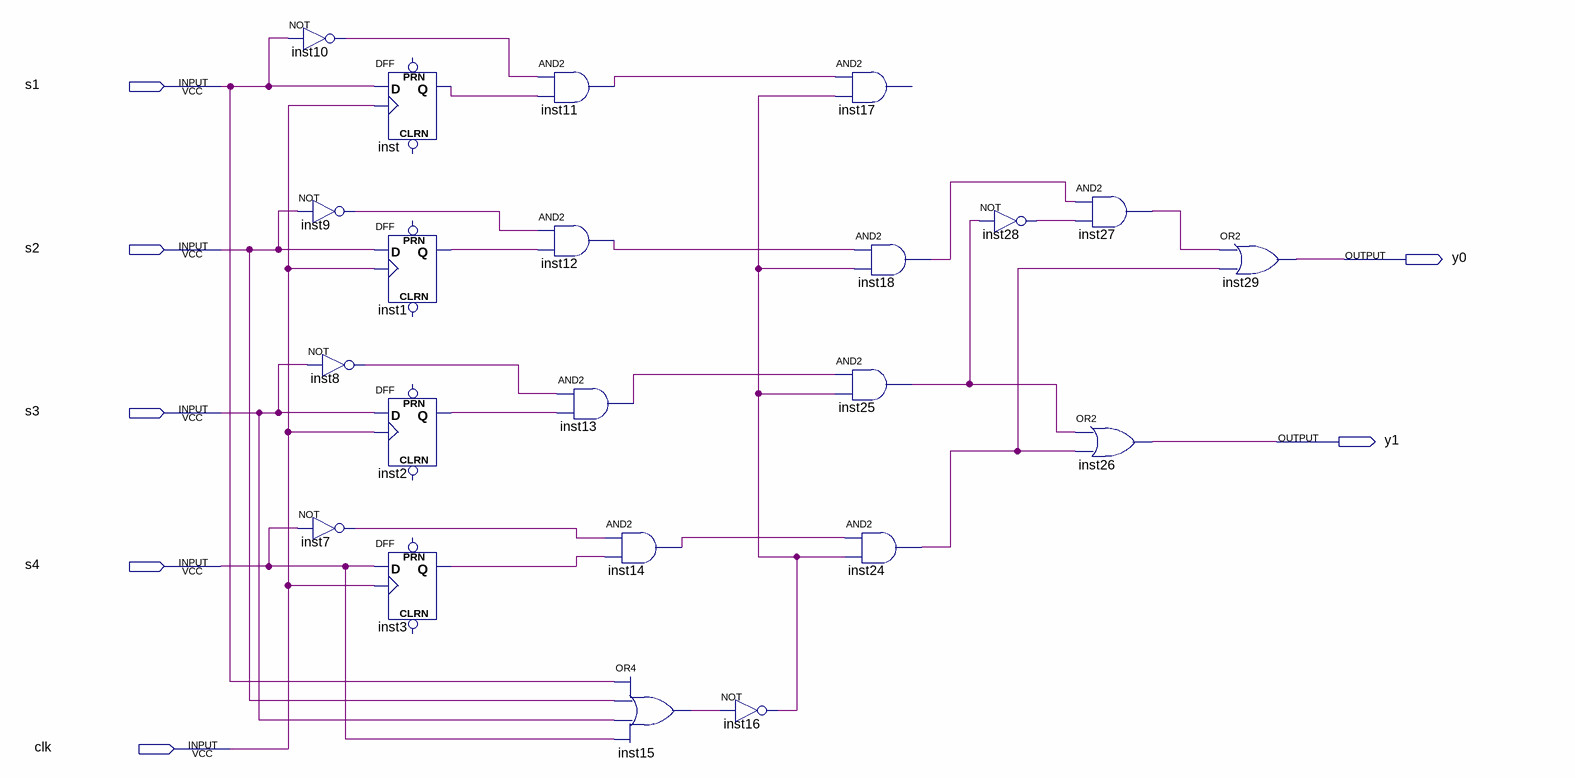
[diagram p0: schematic sheet]
// Quartus schematic sd.bdf as structural Verilog: 22 symbols, 7 pins
module sd (
  input  s1,
  input  s2,
  input  s3,
  input  s4,
  input  clk,
  output y0,
  output y1
);

  wire inst1_q, inst2_q, inst3_q, inst7_out, inst8_out, inst9_out, inst10_out, inst11_out, inst12_out,
       inst13_out, inst14_out, inst15_out, inst16_out, inst18_out, inst24_out, inst25_out, inst27_out,
       inst28_out, inst_q;

  not inst10 (inst10_out, s1);
  not inst9 (inst9_out, s2);
  not inst8 (inst8_out, s3);
  not inst7 (inst7_out, s4);
  DFF inst (.CLK(clk), .D(s1), .Q(inst_q));  // open: CLRN, PRN
  DFF inst1 (.CLK(clk), .D(s2), .Q(inst1_q));  // open: CLRN, PRN
  DFF inst2 (.CLK(clk), .D(s3), .Q(inst2_q));  // open: CLRN, PRN
  DFF inst3 (.CLK(clk), .D(s4), .Q(inst3_q));  // open: CLRN, PRN
  and inst11 (inst11_out, inst10_out, inst_q);
  and inst12 (inst12_out, inst9_out, inst1_q);
  and inst13 (inst13_out, inst8_out, inst2_q);
  and inst14 (inst14_out, inst7_out, inst3_q);
  or inst15 (inst15_out, s1, s2, s3, s4);
  not inst16 (inst16_out, inst15_out);
  // AND2 inst17 has open pins: IN1=inst11_out, IN2=inst16_out, OUT=open
  and inst18 (inst18_out, inst12_out, inst16_out);
  and inst25 (inst25_out, inst13_out, inst16_out);
  and inst24 (inst24_out, inst14_out, inst16_out);
  not inst28 (inst28_out, inst25_out);
  and inst27 (inst27_out, inst18_out, inst28_out);
  or inst26 (y1, inst25_out, inst24_out);
  or inst29 (y0, inst27_out, inst24_out);
endmodule
